# Altium schematic sheet ALLPRINT-CAPBOARD-677512-POWER.SchDoc
size A3; Organization: Altium Limited; Address1: 3 Minna Close; Address2: Belrose; Address3: NSW 2085; Address4: Australia; DocumentNumber: 5; SheetNumber: 4; SheetTotal: 11
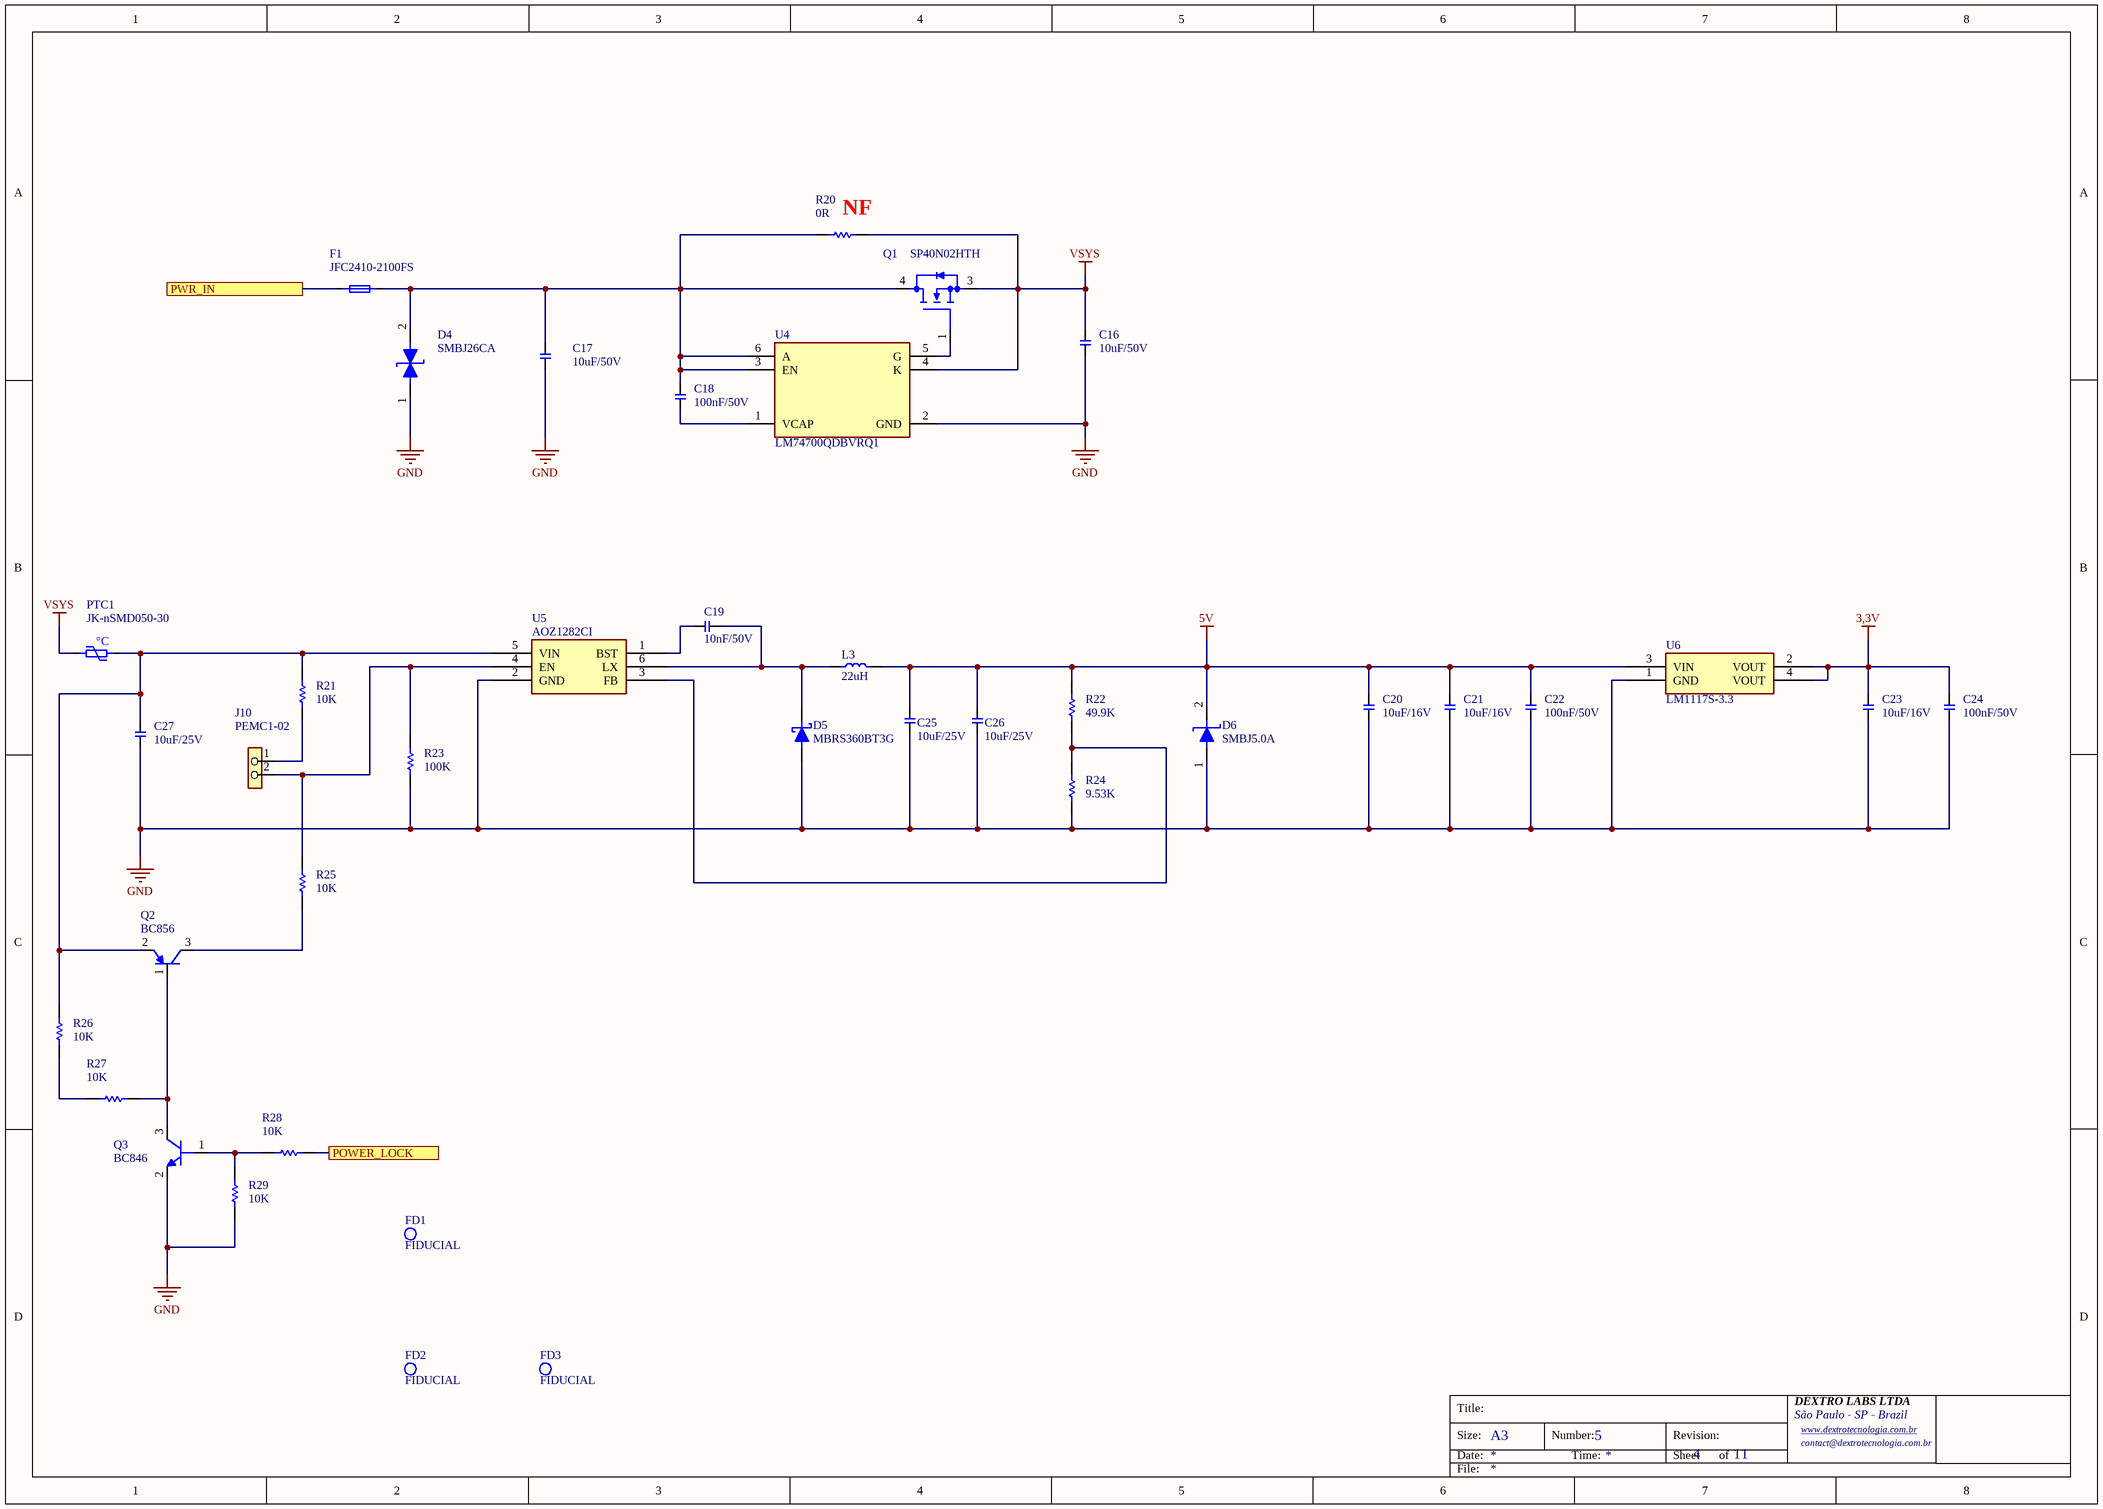
[diagram p0: ALLPRINT-CAPBOARD-677512-POWER.SchDoc]

## Parts
C16  10uF/50V  [CAP-0805]
C17  10uF/50V  [CAP-0805]
C18  100nF/50V  [CAP-0603]
C19  10nF/50V  [CAP-0603]
C20  10uF/16V  [CAP-0603]
C21  10uF/16V  [CAP-0603]
C22  100nF/50V  [CAP-0603]
C23  10uF/16V  [CAP-0603]
C24  100nF/50V  [CAP-0603]
C25  10uF/25V  [CAP-0805]
C26  10uF/25V  [CAP-0805]
C27  10uF/25V  [CAP-0805]
D4  SMBJ26CA  [DO214-AA]
D5  MBRS360BT3G  [DO214-AA]
D6  SMBJ5.0A  [DO214-AA]
F1  JFC2410-2100FS  [FUSE-2410]
FD1  FIDUCIAL  [FIDUCIAL]
FD2  FIDUCIAL  [FIDUCIAL]
FD3  FIDUCIAL  [FIDUCIAL]
J10  PEMC1-02  [PEMC1-02]
L3  22uH  [INDUTOR-6672]
PTC1  JK-nSMD050-30  [PTC-1206]
Q1  SP40N02HTH  [TO-252-2]
Q2  BC856  [SOT23-3]
Q3  BC846  [SOT23-3]
R20  0R  [RES-1206]
R21  10K  [RES-0603]
R22  49.9K  [RES-0603]
R23  100K  [RES-0603]
R24  9.53K  [RES-0603]
R25  10K  [RES-0603]
R26  10K  [RES-0603]
R27  10K  [RES-0603]
R28  10K  [RES-0603]
R29  10K  [RES-0603]
U4  LM74700QDBVRQ1  [SOT23-6]
U5  AOZ1282CI  [SOT23-6]
U6  LM1117S-3.3  [SOT223]

## Ports
POWER_LOCK (see ALLPRINT-CAPBOARD-677512-GENERAL[3C], ALLPRINT-CAPBOARD-677512-MCU[5A]), PWR_IN (see ALLPRINT-CAPBOARD-677512-GENERAL[4C])

## Nets
3,3V: C23.2 C24.2 U6.2(VOUT) U6.4(VOUT)
5V: C20.2 C21.2 C22.2 C25.2 C26.2 D6.2(K) L3.2 R22.2 U6.3(VIN)
GND: C16.1 C17.1 C20.1 C21.1 C22.1 C23.1 C24.1 C25.1 C26.1 C27.1 D4.1(A1) D5.1(A) D6.1(A) Q3.2 R23.1 R24.1 R29.2 U4.2(GND) U5.2(GND) U6.1(GND)
VSYS: C16.2 PTC1.1 Q1.3(S) R20.2 U4.4(K)
POWER_LOCK: R28.1 ; port POWER_LOCK
PWR_IN: F1.1 ; port PWR_IN
NetC17_2: C17.2 C18.2 D4.2(A2) F1.2 Q1.4(D) R20.1 U4.3(EN) U4.6(A)
NetC18_1: C18.1 U4.1(VCAP)
NetC19_1: C19.1 D5.2(K) L3.1 U5.6(LX)
NetC19_2: C19.2 U5.1(BST)
NetC27_2: C27.2 PTC1.2 Q2.2(E) R21.1 R26.2 U5.5(VIN)
NetJ10_1: J10.1 R21.2
NetJ10_2: J10.2 R23.2 R25.1 U5.4(EN)
NetQ1_1: Q1.1(G]) U4.5(G)
NetQ2_1: Q2.1(B) Q3.3 R27.1
NetQ2_3: Q2.3(C) R25.2
NetQ3_1: Q3.1 R28.2 R29.1
NetR22_1: R22.1 R24.2 U5.3(FB)
NetR26_1: R26.1 R27.2

## Notes on the sheet
- (near R20) NF
- Title:
- Size:
- Date:
- A3
- Number:
- Time:
- Revision:
- Sheet
- of
- DEXTRO LABS LTDA
- São Paulo - SP - Brazil
- www.dextrotecnologia.com.br <http://www.dextrotecnologia.com.br>
- contact@dextrotecnologia.com.br
- File:
- (in symbol PTC-FUSE-30V-500mA-1206) °C

## Library data of the parts
C16 C17 = CAP-10uF/50V-0805-X5R-MLCC: 50V 10uF X5R ±10% 1206 Multilayer Ceramic Capacitors MLCC - SMD/SMT ROHS; LCSC: C13585
C18 C22 C24 = CAP-100nF/50V-0603-X7R-MLCC: 50V 100nF X7R ±10% 0603 Multilayer Ceramic Capacitors MLCC - SMD/SMT ROHS; LCSC: C14663
C19 = CAP-10nF/50V-0603-X7R-MLCC: 50V 10nF X7R ±10% 0603 Multilayer Ceramic Capacitors MLCC - SMD/SMT ROHS; LCSC: C1589
C20 C21 C23 = CAP-10uF/16V-0603-X5R: 16V 10uF X5R ±20% 0603 Multilayer Ceramic Capacitors MLCC - SMD/SMT ROHS; LCSC: C92487
C25-C27 = CAP-10uF/25V-0805-X5R-MLCC: 25V 10uF X5R ±10% 0805 Ceramic Capacitors ROHS; LCSC: C15850
D4 = SMBJ26CA: 28.9V 26V 42.1V 14.2A 600W Bidirectional DO-214AA(SMB) TVS Diodes RoHS; LCSC: C908854
D5 = DIODE-SCHOTTKY-60V-3A-MBRS360BT3G: 125A 60V 630mV@3A 3A SMB(DO-214AA) Single Diodes RoHS; LCSC: C59027
D6 = SMBJ5.0A: 65.3A 600W 9.2V 6.4V Unidirectional 5V DO-214AA TVS Diodes RoHS; LCSC: C83333
F1 = FUSE-125V-10A-2410: 125V Surface Mount Fuse 10A 2410 Fuses RoHS; LCSC: C136374
J10 = PEMC1-02: CONECTOR PASSO 2,5mm / 250VCA / 3A / 10mOHMS
L3 = FIXED-INDUCTOR-SMD-22uH-7.2X6.6mm-2.6A-110mΩ: 2.6A 22uH ±20% 110mΩ SMD,7.2x6.6mm Fixed Inductors RoHS; LCSC: C5189963
PTC1 = PTC-FUSE-30V-500mA-1206: 30V 500mA 100A 1A 150mΩ 1206 PTC Resettable Fuses ROHS; LCSC: C720075
Q1 = TRAN-MOSFET-N-CHAN-40V-130A-DPAK: 40V 130A 2.5mΩ@10V 125W TO-252 Single FETs, MOSFETs RoHS; LCSC: C41354884
Q2 = TRANSISTOR-BC856B,215: 65V 220@2mA,5V 250mW 100mA PNP SOT-23 Bipolar (BJT) ROHS; LCSC: C109310
Q3 = TRANSISTOR-BC846B,215-SOT23: 65V 200@10mA,5V 250mW 100mA NPN SOT-23 Bipolar (BJT) ROHS; LCSC: C87062
R20 = RES-0R-1%-250mW-1206: 0Ω 250mW 200V Thick Film Resistor ±1% 1206 Chip Resistor - Surface Mount RoHS; LCSC: C137394
R21 R25-R29 = RES-10K-1%-100mW-0603: 100mW Thick Film Resistor 75V ±100ppm/℃ ±1% 10kΩ 0603 Chip Resistor - Surface Mount ROHS; LCSC: C98220
R22 = RES-49.9K-1%-100mW-0603: 100mW 49.9kΩ 75V ±100ppm/℃ Thick Film Resistor ±1% 0603 Chip Resistor - Surface Mount ROHS; LCSC: C114624
R23 = RES-100K-1%-100mW-0603: 100mW Thick Film Resistor 75V ±100ppm/℃ ±1% 100kΩ 0603 Chip Resistor - Surface Mount ROHS; LCSC: C14675
R24 = RES-9.53K-1%-100mW-0603: 100mW 9.53kΩ 75V ±100ppm/℃ Thick Film Resistor ±1% 0603 Chip Resistor - Surface Mount ROHS; LCSC: C2960722
U4 = IC-OR-CONTROLLER-LM74700QDBVRQ1: Low IQ Battery Reverse Protection Ideal Diode Controller; LCSC: C2941042
U5 = AOZ1282CI: Step-down type Adjustable 800mV~36V 1.2A 4.5V~36V SOT-23-6 DC-DC Converters ROHS; LCSC: C111916
U6 = LM1117S-3.3: LCSC: C126027